# EAGLE schematic uC board (EAGLE 9.4.1)
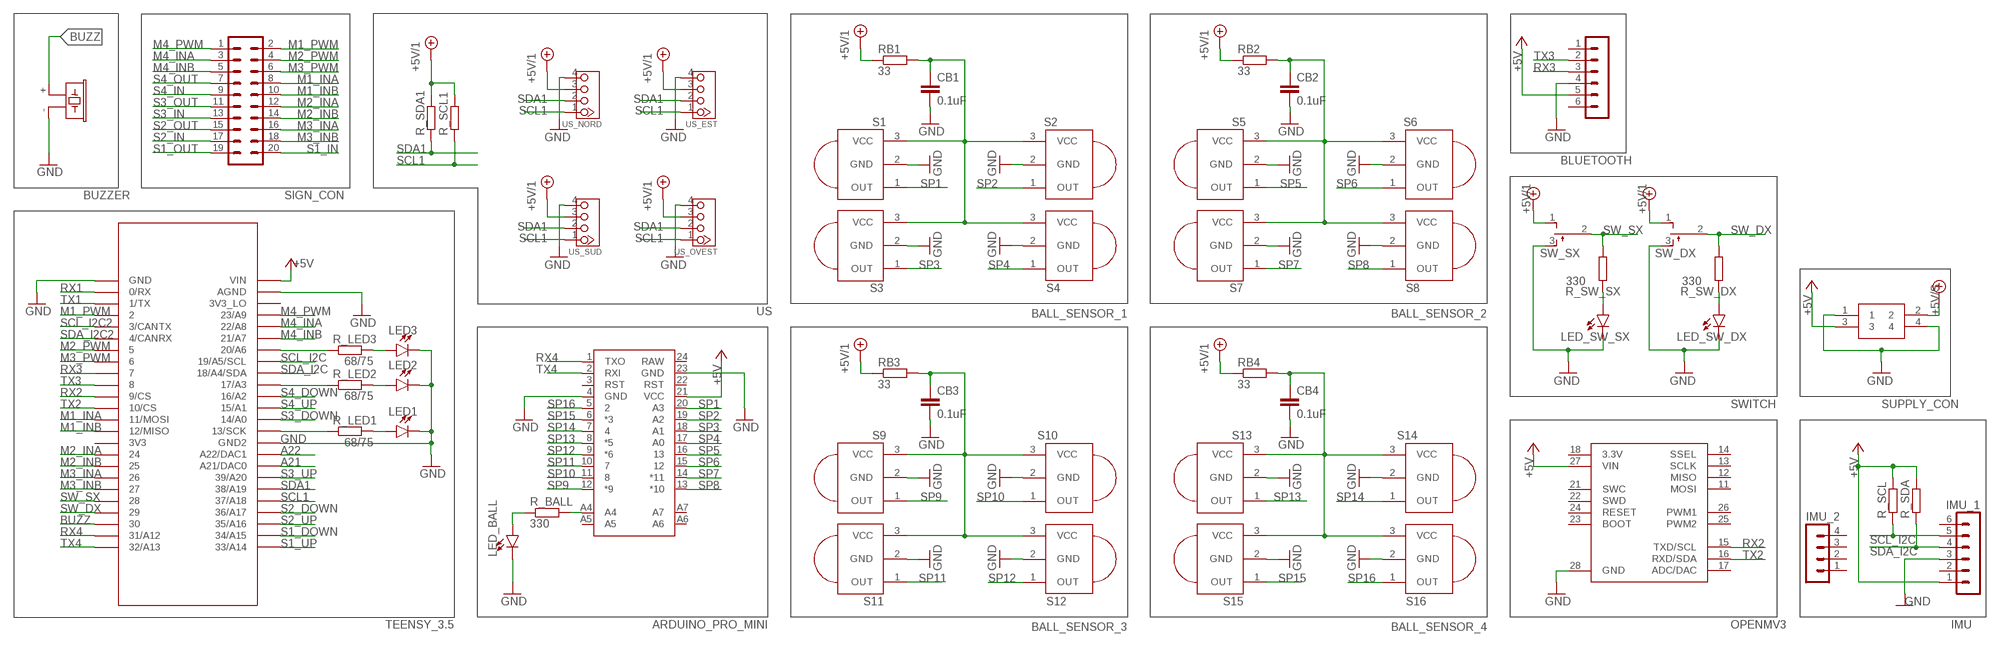
[diagram p0: schematic, sheet 1]

## Parts
ARDUINO_PRO_MINI  ARDUINO_PRO_MINI  [ARDUINO_PRO_MINI]
BLUETOOTH  MA06-1  [MA06-1]
BUZZER  F/CM12P  [F/CM12P]
CB1  0.1uF  C-EUC1206  [C1206]
CB2  0.1uF  C-EUC1206  [C1206]
CB3  0.1uF  C-EUC1206  [C1206]
CB4  0.1uF  C-EUC1206  [C1206]
IMU_1  MA06-1  [MA06-1]
IMU_2  MA04-1  [MA04-1]
J1  39-28-1043  [39-28-1043]
LED1  LED3MM  [LED_3MM]
LED2  LED3MM  [LED_3MM]
LED3  LED3MM  [LED_3MM]
LED_BALL  LED3MM  [LED_3MM]
LED_SW_DX  LED3MM  [LED_3MM]
LED_SW_SX  LED3MM  [LED_3MM]
R_BALL  330  R-EU_R1206  [R1206]
R_LED1  68/75  R-EU_R0805  [R0805]
R_LED2  68/75  R-EU_R0805  [R0805]
R_LED3  68/75  R-EU_R0805  [R0805]
R_SCL  3.3k  R-EU_R0805  [R0805]
R_SCL1  3.3k  R-EU_R0805  [R0805]
R_SDA  3.3k  R-EU_R0805  [R0805]
R_SDA1  3.3k  R-EU_R0805  [R0805]
R_SW_DX  330  R-EU_R1206  [R1206]
R_SW_SX  330  R-EU_R1206  [R1206]
RB1  33  R-EU_R0805  [R0805]
RB2  33  R-EU_R0805  [R0805]
RB3  33  R-EU_R0805  [R0805]
RB4  33  R-EU_R0805  [R0805]
S1  PNA460XM  [PNA460XM]
S2  PNA460XM  [PNA460XM]
S3  PNA460XM  [PNA460XM]
S4  PNA460XM  [PNA460XM]
S5  PNA460XM  [PNA460XM]
S6  PNA460XM  [PNA460XM]
S7  PNA460XM  [PNA460XM]
S8  PNA460XM  [PNA460XM]
S9  PNA460XM  [PNA460XM]
S10  PNA460XM  [PNA460XM]
S11  PNA460XM  [PNA460XM]
S12  PNA460XM  [PNA460XM]
S13  PNA460XM  [PNA460XM]
S14  PNA460XM  [PNA460XM]
S15  PNA460XM  [PNA460XM]
S16  PNA460XM  [PNA460XM]
SIGN_CON  20V  [20V]
SW_DX  TL38PO  [TL3XPO]
SW_SX  TL38PO  [TL3XPO]
TEENSY_3.5  TEENSY_3.5/3.6  [TEENSY_3.5/3.6]
U$2  OPENMV3  [OPENMV3]
US_EST  TWIG_2.0  [2.0_1X4]
US_NORD  TWIG_2.0  [2.0_1X4]
US_OVEST  TWIG_2.0  [2.0_1X4]
US_SUD  TWIG_2.0  [2.0_1X4]

## Nets
+5V: ARDUINO_PRO_MINI.21(VCC) BLUETOOTH.5 IMU_1.1 J1.3 R_SCL.2 R_SDA.2 TEENSY_3.5.VIN U$2.27(VIN)
+5V/S [+5V/1]: J1.2 R_SCL1.2 R_SDA1.2 RB1.1 RB2.1 RB3.1 RB4.1 SW_DX.1(O) SW_SX.1(O) US_EST.3 US_NORD.3 US_OVEST.3 US_SUD.3 ; supply symbol labelled +5V/1
A21: TEENSY_3.5.21/DAC0(A21/DAC0)
A22: TEENSY_3.5.A22/DAC1
BUZZ: BUZZER.+ TEENSY_3.5.30
GND [Power]: ARDUINO_PRO_MINI.4(GND) ARDUINO_PRO_MINI.23(GND) BLUETOOTH.4 BUZZER.- CB1.2 CB2.2 CB3.2 CB4.2 IMU_1.3 J1.1 J1.4 LED1.K(C) LED2.K(C) LED3.K(C) LED_BALL.K(C) LED_SW_DX.K(C) LED_SW_SX.K(C) S1.2(GND) S2.2(GND) S3.2(GND) S4.2(GND) S5.2(GND) S6.2(GND) S7.2(GND) S8.2(GND) S9.2(GND) S10.2(GND) S11.2(GND) S12.2(GND) S13.2(GND) S14.2(GND) S15.2(GND) S16.2(GND) SW_DX.3(S) SW_SX.3(S) TEENSY_3.5.AGND TEENSY_3.5.GND TEENSY_3.5.GND2 U$2.28(GND) US_EST.4 US_NORD.4 US_OVEST.4 US_SUD.4
M1_INA: SIGN_CON.8 TEENSY_3.5.11/MOSI
M1_INB: SIGN_CON.10 TEENSY_3.5.12/MISO
M1_PWM: SIGN_CON.2 TEENSY_3.5.2
M2_INA: SIGN_CON.12 TEENSY_3.5.24
M2_INB: SIGN_CON.14 TEENSY_3.5.25
M2_PWM: SIGN_CON.4 TEENSY_3.5.5
M3_INA: SIGN_CON.16 TEENSY_3.5.26
M3_INB: SIGN_CON.18 TEENSY_3.5.27
M3_PWM: SIGN_CON.6 TEENSY_3.5.6
M4_INA: SIGN_CON.3 TEENSY_3.5.22/A8
M4_INB: SIGN_CON.5 TEENSY_3.5.21/A7
M4_PWM: SIGN_CON.1 TEENSY_3.5.23/A9
N$1: R_LED1.1 TEENSY_3.5.13/SCK
N$2: LED1.A R_LED1.2
N$3: LED_BALL.A R_BALL.1
N$4: ARDUINO_PRO_MINI.A4 R_BALL.2
N$5: LED_SW_SX.A R_SW_SX.1
N$6: LED2.A R_LED2.2
N$7: LED3.A R_LED3.2
N$8: R_LED3.1 TEENSY_3.5.20/A6
N$10: R_LED2.1 TEENSY_3.5.17/A3
N$11: LED_SW_DX.A R_SW_DX.1
POWER_BLOK_1: CB2.1 RB2.2 S5.3(VCC) S6.3(VCC) S7.3(VCC) S8.3(VCC)
POWER_BLOK_2: CB1.1 RB1.2 S1.3(VCC) S2.3(VCC) S3.3(VCC) S4.3(VCC)
POWER_BLOK_3: CB3.1 RB3.2 S9.3(VCC) S10.3(VCC) S11.3(VCC) S12.3(VCC)
POWER_BLOK_4: CB4.1 RB4.2 S13.3(VCC) S14.3(VCC) S15.3(VCC) S16.3(VCC)
RX1: TEENSY_3.5.0/RX
RX2: TEENSY_3.5.9/CS U$2.15(TXD/SCL)
RX3: BLUETOOTH.3 TEENSY_3.5.7
RX4: ARDUINO_PRO_MINI.1(TXO) TEENSY_3.5.31/A12
S1_DOWN: TEENSY_3.5.34/A15
S1_IN: SIGN_CON.20
S1_OUT: SIGN_CON.19
S1_UP: TEENSY_3.5.33/A14
S2_DOWN: TEENSY_3.5.36/A17
S2_IN: SIGN_CON.17
S2_OUT: SIGN_CON.15
S2_UP: TEENSY_3.5.35/A16
S3_DOWN: TEENSY_3.5.14/A0
S3_IN: SIGN_CON.13
S3_OUT: SIGN_CON.11
S3_UP: TEENSY_3.5.39/A20
S4_DOWN: TEENSY_3.5.16/A2
S4_IN: SIGN_CON.9
S4_OUT: SIGN_CON.7
S4_UP: TEENSY_3.5.15/A1
SCL1: R_SCL1.1 TEENSY_3.5.37/A18 US_EST.1 US_NORD.1 US_OVEST.1 US_SUD.1
SCL_I2C: IMU_1.5 R_SCL.1 TEENSY_3.5.19/A5/SCL
SCL_I2C2: TEENSY_3.5.3/CANTX
SDA1: R_SDA1.1 TEENSY_3.5.38/A19 US_EST.2 US_NORD.2 US_OVEST.2 US_SUD.2
SDA_I2C: IMU_1.4 R_SDA.1 TEENSY_3.5.18/A4/SDA
SDA_I2C2: TEENSY_3.5.4/CANRX
SP1: ARDUINO_PRO_MINI.20(A3) S1.1(OUT)
SP2: ARDUINO_PRO_MINI.19(A2) S2.1(OUT)
SP3: ARDUINO_PRO_MINI.18(A1) S3.1(OUT)
SP4: ARDUINO_PRO_MINI.17(A0) S4.1(OUT)
SP5: ARDUINO_PRO_MINI.16 S5.1(OUT)
SP6: ARDUINO_PRO_MINI.15 S6.1(OUT)
SP7: ARDUINO_PRO_MINI.14(*11) S7.1(OUT)
SP8: ARDUINO_PRO_MINI.13(*10) S8.1(OUT)
SP9: ARDUINO_PRO_MINI.12(*9) S9.1(OUT)
SP10: ARDUINO_PRO_MINI.11 S10.1(OUT)
SP11: ARDUINO_PRO_MINI.10 S11.1(OUT)
SP12: ARDUINO_PRO_MINI.9(*6) S12.1(OUT)
SP13: ARDUINO_PRO_MINI.8(*5) S13.1(OUT)
SP14: ARDUINO_PRO_MINI.7 S14.1(OUT)
SP15: ARDUINO_PRO_MINI.6(*3) S15.1(OUT)
SP16: ARDUINO_PRO_MINI.5 S16.1(OUT)
SW_DX: R_SW_DX.2 SW_DX.2(P) TEENSY_3.5.29
SW_SX: R_SW_SX.2 SW_SX.2(P) TEENSY_3.5.28
TX1: TEENSY_3.5.1/TX
TX2: TEENSY_3.5.10/CS U$2.16(RXD/SDA)
TX3: BLUETOOTH.2 TEENSY_3.5.8
TX4: ARDUINO_PRO_MINI.2(RXI) TEENSY_3.5.32/A13
Unconnected: ARDUINO_PRO_MINI.3(RST) ARDUINO_PRO_MINI.22(RST) ARDUINO_PRO_MINI.A5 ARDUINO_PRO_MINI.A6 ARDUINO_PRO_MINI.A7 BLUETOOTH.1 BLUETOOTH.6 IMU_1.2 IMU_1.6 IMU_2.1 IMU_2.2 IMU_2.3 IMU_2.4 TEENSY_3.5.3V3 TEENSY_3.5.3V3_LO U$2.11(MOSI) U$2.12(MISO) U$2.13(SCLK) U$2.14(SSEL) U$2.17(ADC/DAC) U$2.18(3.3V) U$2.21(SWC) U$2.22(SWD) U$2.23(BOOT) U$2.24(RESET) U$2.25(PWM2) U$2.26(PWM1)

## Notes on the sheet
- BUZZER
- BALL_SENSOR_1 | BALL_SENSOR_2
- US
- SWITCH | SUPPLY_CON
- BALL_SENSOR_3 | BALL_SENSOR_4
- TEENSY_3.5 | IMU

## Power pins joined to a net without a drawn wire
RAW: ARDUINO_PRO_MINI.24(RAW)

## Library data of the parts
ARDUINO_PRO_MINI = SparkFun-Boards:ARDUINO_PRO_MINI: SparkFun Pro Mini Pro Mini compatible footprint. Dimensions: 0.7 x 1.3" PCB Thickness: 0.8mm SparkFun Products: 3.3V/8MHz <https://www.sparkfun.com/products/11114> 5V/16MHz <https://www.sparkfun.com/products/11113>
BLUETOOTH IMU_1 = con-lstb:MA06-1: PIN HEADER; OC_FARNELL: unknown; OC_NEWARK: unknown
BUZZER = buzzer:F/CM12P: BUZZER Source: Buerklin; OC_FARNELL: unknown; OC_NEWARK: unknown
CB1-CB4 = rcl:C-EU: CAPACITOR, European symbol; SPICEPREFIX: C
IMU_2 = con-lstb:MA04-1: PIN HEADER; OC_FARNELL: unknown; OC_NEWARK: unknown
J1 = 39-28-1043:39-28-1043: Mini-Fit Jr. Vertical Header, 4.20mm Pitch, Dual Row, 4 Circuits, without Snap-in Plastic Peg PCB Lock, Tin, Natural Source: Datasheet <http://docs-emea.rs-online.com/webdocs/0460/0900766b80460da1.pdf>; DESCRIPTION: Mini-Fit Jr. Vertical Header, 4.20mm Pitch, Dual Row, 4 Circuits, without Snap-in Plastic Peg PCB Lock, Tin, Natural; HEIGHT: mm; MANUFACTURER_NAME: Molex; MANUFACTURER_PART_NUMBER: 39-28-1043; MOUSER_PART_NUMBER: 538-39-28-1043; MOUSER_PRICE-STOCK: https://www.mouser.com/Search/Refine.aspx?Keyword=538-39-28-1043; RS_PART_NUMBER: 4841899P; RS_PRICE-STOCK: http://uk.rs-online.com/web/p/products/4841899P
LED1-LED3 LED_BALL LED_SW_DX LED_SW_SX = SparkFun-LED:LED: LED (Generic) Standard schematic elements and footprints for 5mm, 3mm, 1206, and 0603 sized LEDs. Generic LEDs with no color specified.; PROD_ID: DIO-08794
R_BALL R_LED1-R_LED3 R_SCL R_SCL1 R_SDA R_SDA1 R_SW_DX R_SW_SX RB1-RB4 = rcl:R-EU_: RESISTOR, European symbol; SPICEPREFIX: R
S1-S16 = Adafruit:PNA460XM: IR 38KHz receiver PNA4602 and related receivers http://www.ladyada.net/library/pcb/eaglelibrary.html
SIGN_CON = con-harting-v-edit:20V: CONNECTOR; OC_FARNELL: unknown; OC_NEWARK: unknown
SW_DX SW_SX = switch:TL38PO: TINY SWITCH ON OFF MOM Source: http://www2.produktinfo.conrad.com/datenblaetter/700000-724999/705152-da-01-de-Subminiaturschalter_TL_36YO.pdf
TEENSY_3.5 = Teensy356:TEENSY_3.5/3.6
U$2 = openmv:OPENMV3
US_EST US_NORD US_OVEST US_SUD = CONNECTER:TWIG_2.0

## Net classes
0 signal: width 0.254 mm, clearance 0.254 mm
1 Power: width 0.305 mm, clearance 0.305 mm
2 +5V/1: width 0.61 mm, drill 0.406 mm, clearance 0.457 mm